# Altium schematic sheet 08. PMIC.SchDoc
size A3
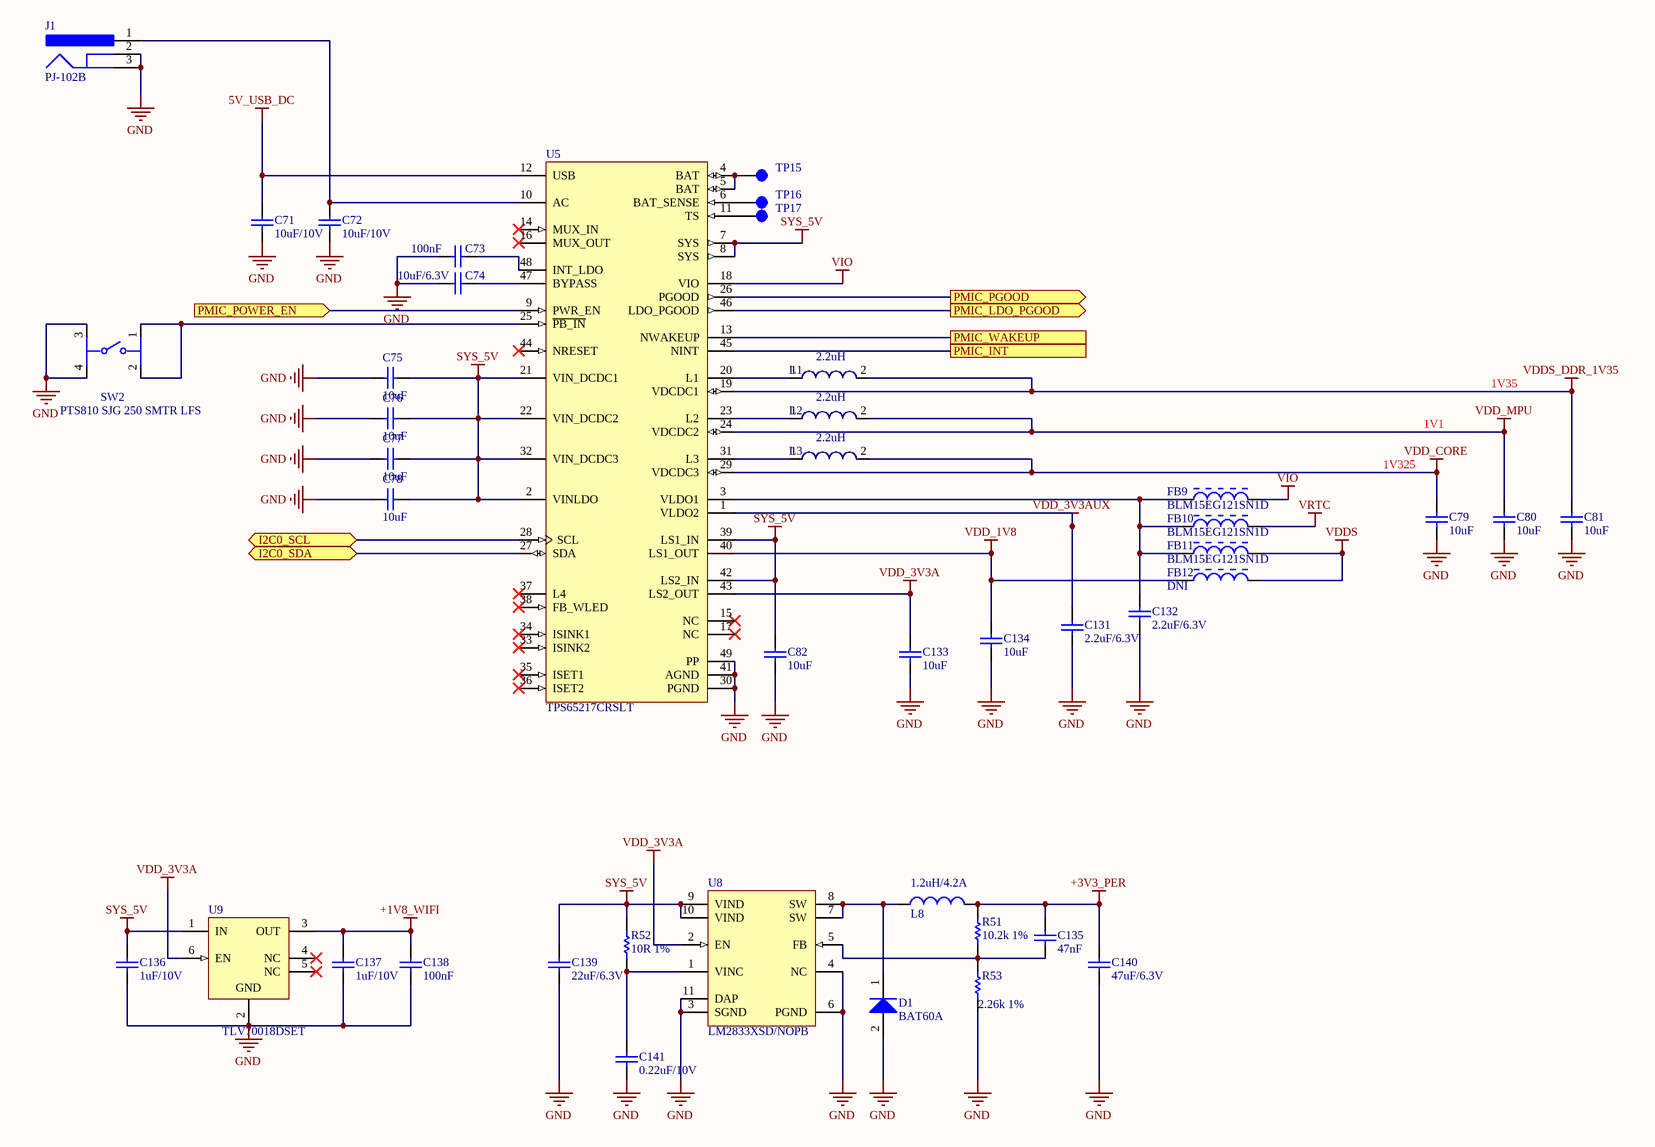
[diagram p0: 08. PMIC.SchDoc]

## Parts
C71  10uF/10V  [CAPC3225X220X30LL30]
C72  10uF/10V  [CAPC3225X220X30LL30]
C73  100nF  [CAPC1005X55X25ML05T10]
C74  10uF/6.3V  [CAPC1608X90X35NL10T15]
C75  10uF  [CAPC2013X140X45NL15T25]
C76  10uF  [CAPC2013X140X45NL15T25]
C77  10uF  [CAPC2013X140X45NL15T25]
C78  10uF  [CAPC2013X140X45NL15T25]
C79  10uF  [CAPC1608X90X35ML10T15]
C80  10uF  [CAPC1608X90X35ML10T15]
C81  10uF  [CAPC1608X90X35ML10T15]
C82  10uF  [CAPC2013X140X45NL15T25]
C131  2.2uF/6.3V  [CAPC1005X60X30LL05T10]
C132  2.2uF/6.3V  [CAPC1005X60X30LL05T10]
C133  10uF  [CAPC1608X90X35ML10T15]
C134  10uF  [CAPC1608X90X35ML10T15]
C135  47nF  [CAPC1005X60X30NL05T10]
C136  1uF/10V  [CAPC1005X55X25NL05T10]
C137  1uF/10V  [CAPC1005X55X25NL05T10]
C138  100nF  [CAPC1005X55X25ML05T10]
C139  22uF/6.3V  [CAPC2013X140X45NL15T25]
C140  47uF/6.3V  [CAPC2013X145X30ML20]
C141  0.22uF/10V  [CAPC1005X55X25NL05T10]
D1  BAT60A  [INF-SOD323_V]
FB9  BLM15EG121SN1D  [MURA-BLM15-CHIP-2_V]
FB10  BLM15EG121SN1D  [MURA-BLM15-CHIP-2_V]
FB11  BLM15EG121SN1D  [MURA-BLM15-CHIP-2_V]
FB12  DNI  [MURA-BLM15-CHIP-2_V]
J1  PJ-102B  [CUI-PJ-102B_V]
L1  2.2uH  [WE-LQS 3015]
L2  2.2uH  [WE-LQS 3015]
L3  2.2uH  [WE-LQS 3015]
L8  1.2uH/4.2A  [LTF5022T-1R2N4R2-LC]
R51  10.2k 1%  [RESC1005X40X25NL05T10]
R52  10R 1%  [RESC1005X40X25ML05T10]
R53  2.26k 1%  [RESC1005X35X25NL10T10]
SW2  PTS810 SJG 250 SMTR LFS  [FP-PTS810_SJG_250_SMTR_LF-MFG]
TP15  Test Point  [TP]  (value not drawn)
TP16  Test Point  [TP]  (value not drawn)
TP17  Test Point  [TP]  (value not drawn)
U5  TPS65217CRSLT  [RSL0048A]
U8  LM2833XSD/NOPB  [DSC0010A_V]
U9  TLV70018DSET  [DSE0006A_V]

## Ports
I2C0_SCL (bidir), I2C0_SDA (bidir), PMIC_INT, PMIC_LDO_PGOOD (out), PMIC_PGOOD (out), PMIC_POWER_EN (in), PMIC_WAKEUP

## Nets
5V_USB_DC: C71.2 U5.12(USB)
+1V8_WIFI: C137.2 C138.2 U9.3(OUT)
+3V3_PER: C135.2 C140.2 L8.2 R51.2
GND: C71.1 C72.1 C73.1 C74.1 C75.2 C76.2 C77.2 C78.2 C79.1 C80.1 C81.1 C82.1 C131.1 C132.1 C133.1 C134.1 C136.1 C137.1 C138.1 C139.1 C140.1 C141.1 D1.2(A) J1.2 J1.3 R53.1 SW2.3 SW2.4 U5.30(PGND) U5.41(AGND) U5.49(PP) U8.3(SGND) U8.4(NC) U8.6(PGND) U8.11(DAP) U9.2(GND)
SYS_5V: C75.1 C76.1 C77.1 C78.1 C82.2 C136.2 C139.2 R52.2 U5.2(VINLDO) U5.7(SYS) U5.8(SYS) U5.21(VIN_DCDC1) U5.22(VIN_DCDC2) U5.32(VIN_DCDC3) U5.39(LS1_IN) U5.42(LS2_IN) U8.9(VIND) U8.10(VIND) U9.1(IN)
VDD_1V8: C134.2 FB12.1 U5.40(LS1_OUT)
VDD_3V3A: C133.2 U5.43(LS2_OUT) U8.2(EN) U9.6(EN)
VDD_3V3AUX: C131.2 U5.1(VLDO2)
VDD_CORE: C79.2 L3.2 U5.29(VDCDC3)
VDD_MPU: C80.2 L2.2 U5.24(VDCDC2)
VDDS: FB11.2 FB12.2
VDDS_DDR_1V35: C81.2 L1.2 U5.19(VDCDC1)
VIO: FB9.2 U5.18(VIO)
VRTC: FB10.2
I2C0_SCL: U5.28(SCL) ; port I2C0_SCL
I2C0_SDA: U5.27(SDA) ; port I2C0_SDA
PMIC_INT: U5.45(NINT) ; port PMIC_INT
PMIC_LDO_PGOOD: U5.46(LDO_PGOOD) ; port PMIC_LDO_PGOOD
PMIC_PGOOD: U5.26(PGOOD) ; port PMIC_PGOOD
PMIC_POWER_EN: U5.9(PWR_EN) ; port PMIC_POWER_EN
PMIC_WAKEUP: U5.13(NWAKEUP) ; port PMIC_WAKEUP
NetC72_2: C72.2 J1.1 U5.10(AC)
NetC73_2: C73.2 U5.48(INT_LDO)
NetC74_2: C74.2 U5.47(BYPASS)
NetC132_2: C132.2 FB9.1 FB10.1 FB11.1 U5.3(VLDO1)
NetC135_1: C135.1 R51.1 R53.2 U8.5(FB)
NetC141_2: C141.2 R52.1 U8.1(VINC)
NetD1_1: D1.1(K) L8.1 U8.7(SW) U8.8(SW)
NetL1_1: L1.1 U5.20(L1)
NetL2_1: L2.1 U5.23(L2)
NetL3_1: L3.1 U5.31(L3)
NetSW2_1: SW2.1 SW2.2 U5.25(~{PB_IN})
NetTP15_1: TP15.1 U5.4(BAT) U5.5(BAT)
NetTP16_1: TP16.1 U5.6(BAT_SENSE)
NetTP17_1: TP17.1 U5.11(TS)

Not connected (* = marked no-connect by the designer): U5 14(MUX_IN)* 15(NC)* 16(MUX_OUT)* 17(NC)* 33(ISINK2)* 34(ISINK1)* 35(ISET1)* 36(ISET2)* 37(L4)* 38(FB_WLED)* 44(NRESET)*; U9 4(NC)* 5(NC)*

## Notes on the sheet
- 1V35
- (near C79) 1V325
- 1V1
- Title
- Size:
- Date:
- A4
- Number:
- Time:
- Revision:
- Sheet
- of
- N.S.T
- Design by:
- Check by:
- https://github.com/tung080827

## Library data of the parts
C71 C72 = CMP-2000-06359-1: Chip Capacitor, 10 uF, +/- 10%, 25 V, -55 to 125 degC, 1210 (3225 Metric), RoHS, Tape and Reel; Manufacturer: Murata; Construction form: 1210; Ceramic type: X7R; Capacitance: 10µF; Rated voltage: 25VDC; Package Reference: 1210; Datasheet Version: 03/2016; Package Description: 2-Pin Surface Mount Device, Body 3.2 x 2.5 mm; Mounting Technology: SurfaceMount; Manufacturer URL: http://www.murata.com/; Capacitance tolerance: ±10%; Datasheet URL: http://search.murata.co.jp/Ceramy/image/img/A01X/G101/ENG/GRM32DR71E106KA12-01.pdf
C73 C138 = CMP-2100-03641-1: Chip Capacitor, 0.1 uF, +/- 10%, 16 V, -55 to 125 degC, 0402 (1005 Metric), RoHS, Tape and Reel; Manufacturer: Murata; Material: Ceramic; Insulation Resistance: 10GR; Voltage: 16V; Dielectric: X7R; REACH SVHC: NoSVHC; Depth: 0.5mm; Case/Package: 0402; Datasheet URL: http://psearch.en.murata.com/capacitor/product/GRM155R71C104KA88%23.pdf; Lead Free: LeadFree; Dielectric Material: Ceramic; Manufacturer URL: http://www.murata.com/; Min Operating Temperature: -55degC; Length: 1mm; Case Code (Metric): 1005; Radiation Hardening: No; Package Reference: 0402; RoHSCompliant: true; Datasheet Version: 42675.0; Thickness: 0.022inch; Packaging: TapeandReel; Voltage Rating (DC): 16V; Tolerance: 10%; Max Operating Temperature: 125degC; Package Description: 2-Pin Surface Mount Device, Body 1 x 0.5 mm; Mount: SurfaceMount; Height: 0.5mm; Width: 0.5mm; Number of Pins: 2; Voltage Rating: 16V; Case Code (Imperial): 0402; Termination: SMD/SMT; Capacitance: 100nF; Package Quantity: 1
C74 = CMP-2006-02792-1: Part Number: GRM188R60J106ME47D; Manufacturer: Murata
C75-C78 = CMP-2007-03453-1: Chip Capacitor, 10 uF, +/- 10%, 16 V, -55 to 125 degC, 0805 (1608 Metric), RoHS, Tape and Reel; Manufacturer: Murata; Part Number: GRM21BR61C106KE15L
C79-C81 C133 C134 = CMP-2006-02792-1: Chip Capacitor, 10 uF, +/- 10%, 6.3 V, -55 to 125 degC, 0603 (1608 Metric), RoHS, Tape and Reel; Part Number: GRM188R60J106ME47D; Manufacturer: Murata
C82 = CMP-2007-03453-1: Chip Capacitor, 10 uF, +/- 10%, 16 V, -55 to 125 degC, 0805 (2012 Metric), RoHS, Tape and Reel; Manufacturer: Murata; Part Number: GRM21BR61C106KE15L
C131 C132 = CMP-2008-02064-1: Manufacturer: Kemet; Part Number: C0402C225M9PAC7867
C135 = CMP-2008-02209-1: Part Number: C0402C473J8RACTU; Manufacturer: Kemet
C136 C137 = CMP-2008-04556-1: Part Number: GRM155R61A105KE15D; Manufacturer: Murata
C139 = CMP-2007-03385-1: Manufacturer: Murata; Part Number: GRM21BR60J226ME39L
C140 = CMP-2007-03226-1: Manufacturer: Murata; Part Number: GRM21BR60G476ME15L
C141 = CMP-2008-04561-4: Chip Capacitor, 220 nF, +/- 10%, 10 V, -55 to 85 degC, 0402 (1005 Metric), RoHS, Tape and Reel; Manufacturer: Basic Passives; PartNumber: GRM155R61A224KE19D; Case\/Package: 0402; Voltage Rating: 10 V; Type (Capacitors): X5R; Capacitance: 220 nF; Max Operating Temperature: 85 degC; Package Quantity: 1; RoHSCompliant: true; Height: 0.5 mm; Mounting Technology: Surface Mount; Case Code (Metric): 1005; ComponentLink2URL: http://search.murata.co.jp/Ceramy/image/img/A01X/G101/ENG/GRM155R61A224KE19-01.pdf; Case Code (Imperial): 0402; Length: 1 mm; Radiation Hardening: No; Tolerance: 10%; Pins: 2; ComponentLink1Description: Manufacturer URL; Voltage Rating (DC): 10 V; Width: 0.5 mm; REACH SVHC: No SVHC; ComponentLink1URL: http://www.murata.com/; Min Operating Temperature: -55 degC; DatasheetVersion: 03/2016; Mount: Surface Mount; PackageReference: 0402; Packaging: Tape and Reel; ComponentLink2Description: Datasheet; PackageDescription: 2-Pin Surface Mount Device, Body 1 x 0.5 mm
D1 = CMP-1183-00008-2: Silicon Schottky Diode, -55 to 85 degC, SOD323, Reel, Green; Manufacturer: Infineon; Green: TRUE; VR (max): 10Â V; IF (max): 3,000Â mA; VF (max): 370Â mV; CT (max): 35Â pF; Configuration: Single; PackageDescription: 3-Pin Small Outline Transistor Package, 1.25 x 2 mm Body, 0.65 mm Pitch; PartNumber: BAT60A; Mounting Technology: Surface Mount; PackageReference: SOT323; ComponentLink1Description: Manufacturer URL; Packing: Reel; ComponentLink3URL: http://www.infineon.com/dgdl/SOT323-Package_Overview.pdf?folderId=db3a30431936bc4b0119533e1dcb3c92&fileId=db3a30431936bc4b011953495f283cb1; ComponentLink2URL: http://www.infineon.com/dgdl/bat60aseries.pdf?folderId=db3a304313d846880113def5812204a1&fileId=db3a304313d846880113def70c9304a9; ComponentLink1URL: http://www.infineon.com/; ComponentLink2Description: Datasheet; ComponentLink3Description: Package Specification
FB9-FB11 = CMP-0686-00148-3: Chip Ferrite Bead for GHz Band General Use (Low DC Resistance Type), 120 Ohm, 1500 mA, -55 to 125 degC, 1 x 0.5 x 0.55 mm SMD, Tape and Reel; Manufacturer: Murata; Rated Current: 1500 mA; Impedance (at 100 MHz): 120 Ohm +/- 25%; DC Resistance: 0.095 Ohm Max.; ComponentLink3URL: http://www.murata.com/products/catalog/pdf/c31e.pdf; ComponentLink1URL: http://www.murata.com/; Packing: Tape and Reel; Operating Temperature Range: -55 to 125 degC; PackageReference: BLM15-2; ComponentLink2Description: Datasheet; PackageDescription: 2-Pin Chip, Body 1 x 0.5 mm; ComponentLink2URL: http://www.murata.com/products/catalog/pdf/c31e.pdf; Mounting Technology: Surface Mount; ComponentLink3Description: Package Specification; ComponentLink1Description: Manufacturer URL; PartNumber: BLM15EG121SN1D; DatasheetVersion: 08/2013
FB12 = CMP-0686-00148-3: Chip Ferrite Bead for GHz Band General Use (Low DC Resistance Type), 120 Ohm, 1500 mA, -55 to 125 degC, 1 x 0.5 x 0.55 mm SMD, Tape and Reel; PartNumber: BLM15EG121SN1D; Manufacturer: Murata; Rated Current: 1500 mA; Impedance (at 100 MHz): 120 Ohm +/- 25%; DC Resistance: 0.095 Ohm Max.; ComponentLink3URL: http://www.murata.com/products/catalog/pdf/c31e.pdf; ComponentLink1URL: http://www.murata.com/; Packing: Tape and Reel; Operating Temperature Range: -55 to 125 degC; PackageReference: BLM15-2; ComponentLink2Description: Datasheet; PackageDescription: 2-Pin Chip, Body 1 x 0.5 mm; ComponentLink2URL: http://www.murata.com/products/catalog/pdf/c31e.pdf; Mounting Technology: Surface Mount; ComponentLink3Description: Package Specification; ComponentLink1Description: Manufacturer URL; DatasheetVersion: 08/2013
J1 = CMP-2000-06900-1: Through Hole Right Angle DC Power Jack, 2.5 A, 2.5 mm Center Pin, 3 Position, -25 to 85 degC, RoHS, Bulk; Manufacturer: CUIInc.; Insulation Resistance: 100MOhms; Inside Contact Diameter: 2.5mm; Outside Contact Diameter: 6.5mm; Voltage Rating: 24V; Current Rating: 2.5A; Brand: CUI; Datasheet URL: http://www.cui.com/product/resource/pj-102b.pdf; Housing Material: PolybutyleneTerephthalate(PBT); Operating Temperature Range: -25Cto+85C; Package Reference: PJ-102B; Factory Pack Quantity: 280; RoHS: True; Contact Material: Copper; Datasheet Version: Rev. 1.03, 04/2016; Product: Jacks; Mounting Angle: Right; Mounting Style: ThroughHole; Flammability Rating: UL94V-0; Product Category: DCPowerConnectors; Contact Gender: Male; Termination Style: ThroughHole; Manufacturer URL: http://www.cui.com/; Mounting Technology: ThroughHole; Package Description: 3-Pin Through Hole Device, Body 14.4 x 9 mm, Height 11 mm; Contact Plating: Nickel; Packaging: Bulk; Connector Type: DCPowerJack
L1-L3 = CMP-1354-00022-1: WE-LQS SMD Power Inductor, L=2.2 µH; PartNumber: 74404032022; Manufacturer: Wuerth Elektronik; Inductance: 2.2 ÂµH; ComponentLink2URL: http://katalog.we-online.de/pbs/datasheet/74404032022.pdf; ComponentLink1URL: http://www.we-online.com; ComponentLink2Description: Datasheet; ComponentLink1Description: Manufacturer URL; PackageReference: WE-LQS 3015
L8 = Inductor: LTF5022T-1R2N4R2-LC; Supplier 1: Digi-Key
R51 = CMP-2002-07350-1: Manufacturer: Yageo / Phycomp; Part Number: RC0402FR-0710K2L
R52 = CMP-2002-07358-1: Manufacturer: Yageo / Phycomp; Part Number: RC0402FR-0710RL
R53 = CMP-2002-02719-1: Manufacturer: Yageo; Part Number: RT0402BRD072K26L
SW2 = CMP-10040-000011-1: SWITCH TACTILE SPST-NO 0.05A 16V; Manufacturer: C&K Components; Electromechanical Life: 100000Cycles; Contact Resistance: 500mΩ; Operating Force: 400gf; Current Rating: 50mA; Voltage Rating Dc: 16V; Device Class L2: Switches; Device Class L1: Electromechanical; ComponentLink2URL: https://www.ckswitches.com/media/1476/pts810.pdf; Digikey Description: SWITCH TACTILE SPST-NO 0.05A 16V; RoHS: TRUE; Temperature Range Low: -40°C; Temperature Range High: +85°C; Automotive: No; Category: Switch; ComponentLink2Description: Datasheet; Device Class L3: Tactile Switches; Mouser Description: Switch Tactile N.O. SPST Button J-Bend 0.05A 16VDC 100000Cycles 3.92N SMD T/R; Throw Configuration: SPST-NO; Package: PTS810 SJG 250 SMTR LFS; Height: 2.7mm; Octopart: https://octopart.com/pts810sjg250smtrlfs-c%26k+components-29380277; Manufacturer Part Number: PTS810 SJG 250 SMTR LFS; Temperature: -40°C to +85°C; Lead Free: Yes
TP15-TP17 = TP
U5 = CMP-1518-00015-2: 1.2 A, Single-Chip PMIC for Battery-Powered Systems for AM335x ZCZ, DDR3, -40 to 105 degC, 48-pin VQFN (RSL), Green (RoHS & no Sb/Br); Vin(Min)(V): 2.7; Regulated Outputs(#): 7; Iout(Max)(A): 1.2; Packing: Small Tape and Reel; Step-Down DC/DC Converter: 3; Eco-Plan: TRUE; Vin(Max)(V): 5.8; ComponentLink3URL: http://www.ti.com/lit/ds/symlink/tps65070.pdf; PartNumber: TPS65217CRSLT; ComponentLink1URL: http://www.ti.com/; PackageReference: RSL0048A; ComponentLink1Description: Manufacturer URL; ComponentLink2URL: http://www.ti.com/lit/ds/symlink/tps65217c.pdf; ComponentLink3Description: Package Specification; Mounting Technology: Surface Mount; PackageDescription: 48-Pin Plastic Flat Pack, Body 6 x 6 mm, Pitch 0.4 mm; DatasheetVersion: SLVSB64F; ComponentLink2Description: Datasheet; PackageVersion: 4207548/B, 06/2011
U8 = CMP-0069-00941-3: 1.5MHz/3MHz 3.0A Step-Down DC-DC Switching Regulator, 10-pin LLP, Pb-Free; Manufacturer: Texas Instruments; CompType: Switcher; PackageTopMarking: ZXYTT*2833X; PowerWise: N; PackageDescription: LLP, Plastic, Dual, 3 x 3 x 0.8mm Body, 10 Lead, 0.5mm Pitch, No Pullback; ComponentLink1URL: http://www.ti.com/general/docs/lit/getliterature.tsp?genericPartNumber=LM2833&fileType=pdf; PinCount: 10; ComponentLink1Description: Datasheet URL; PackageReference: DSC0010A; RoHS: Y
U9 = CMP-0394-01514-2: Single Output LDO, 200 mA, Fixed 1.8 V Output, 2 to 5.5 V Input, with Low IQ, 6-pin WSON (DSE), -40 to 125 degC, Green (RoHS & no Sb/Br); Manufacturer: Texas Instruments; Fixed Output Options(V): 1.8; Iq(Typ)(mA): 0.03; Vin(Min)(V): 2; Iout(Max)(A): 0.2; Vin(Max)(V): 5.5; SubFamily: Single Channel LDO; Vdo(Typ)(mV): 175; ComponentLink3Description: Package Specification; ComponentLink2URL: http://www.ti.com/general/docs/lit/getliterature.tsp?genericPartNumber=TLV70018&fileType=pdf; PackageReference: DSE0006A; PartNumber: TLV70018DSET; PackageDescription: 6-Pin Plastic Small Outline, Body 1.5 x 1.5 mm, Pitch 0.5 mm; ComponentLink2Description: Datasheet; ComponentLink3URL: http://www.ti.com/litv/pdf/mpds287; Eco-Plan: Green (RoHS & no Sb/Br); Vout Adj(Max)(V): 1.8; DatasheetVersion: SLVSA00D; Accuracy(%): 2; PackageVersion: 4207810/A; ComponentLink1Description: Manufacturer URL; Vout Adj(Min)(V): 1.8; ComponentLink1URL: http://www.ti.com/; Mounting Technology: Surface Mount